# EAGLE design CAN_ProtoBoard_Pro_Mini (EAGLE 7.2.0)
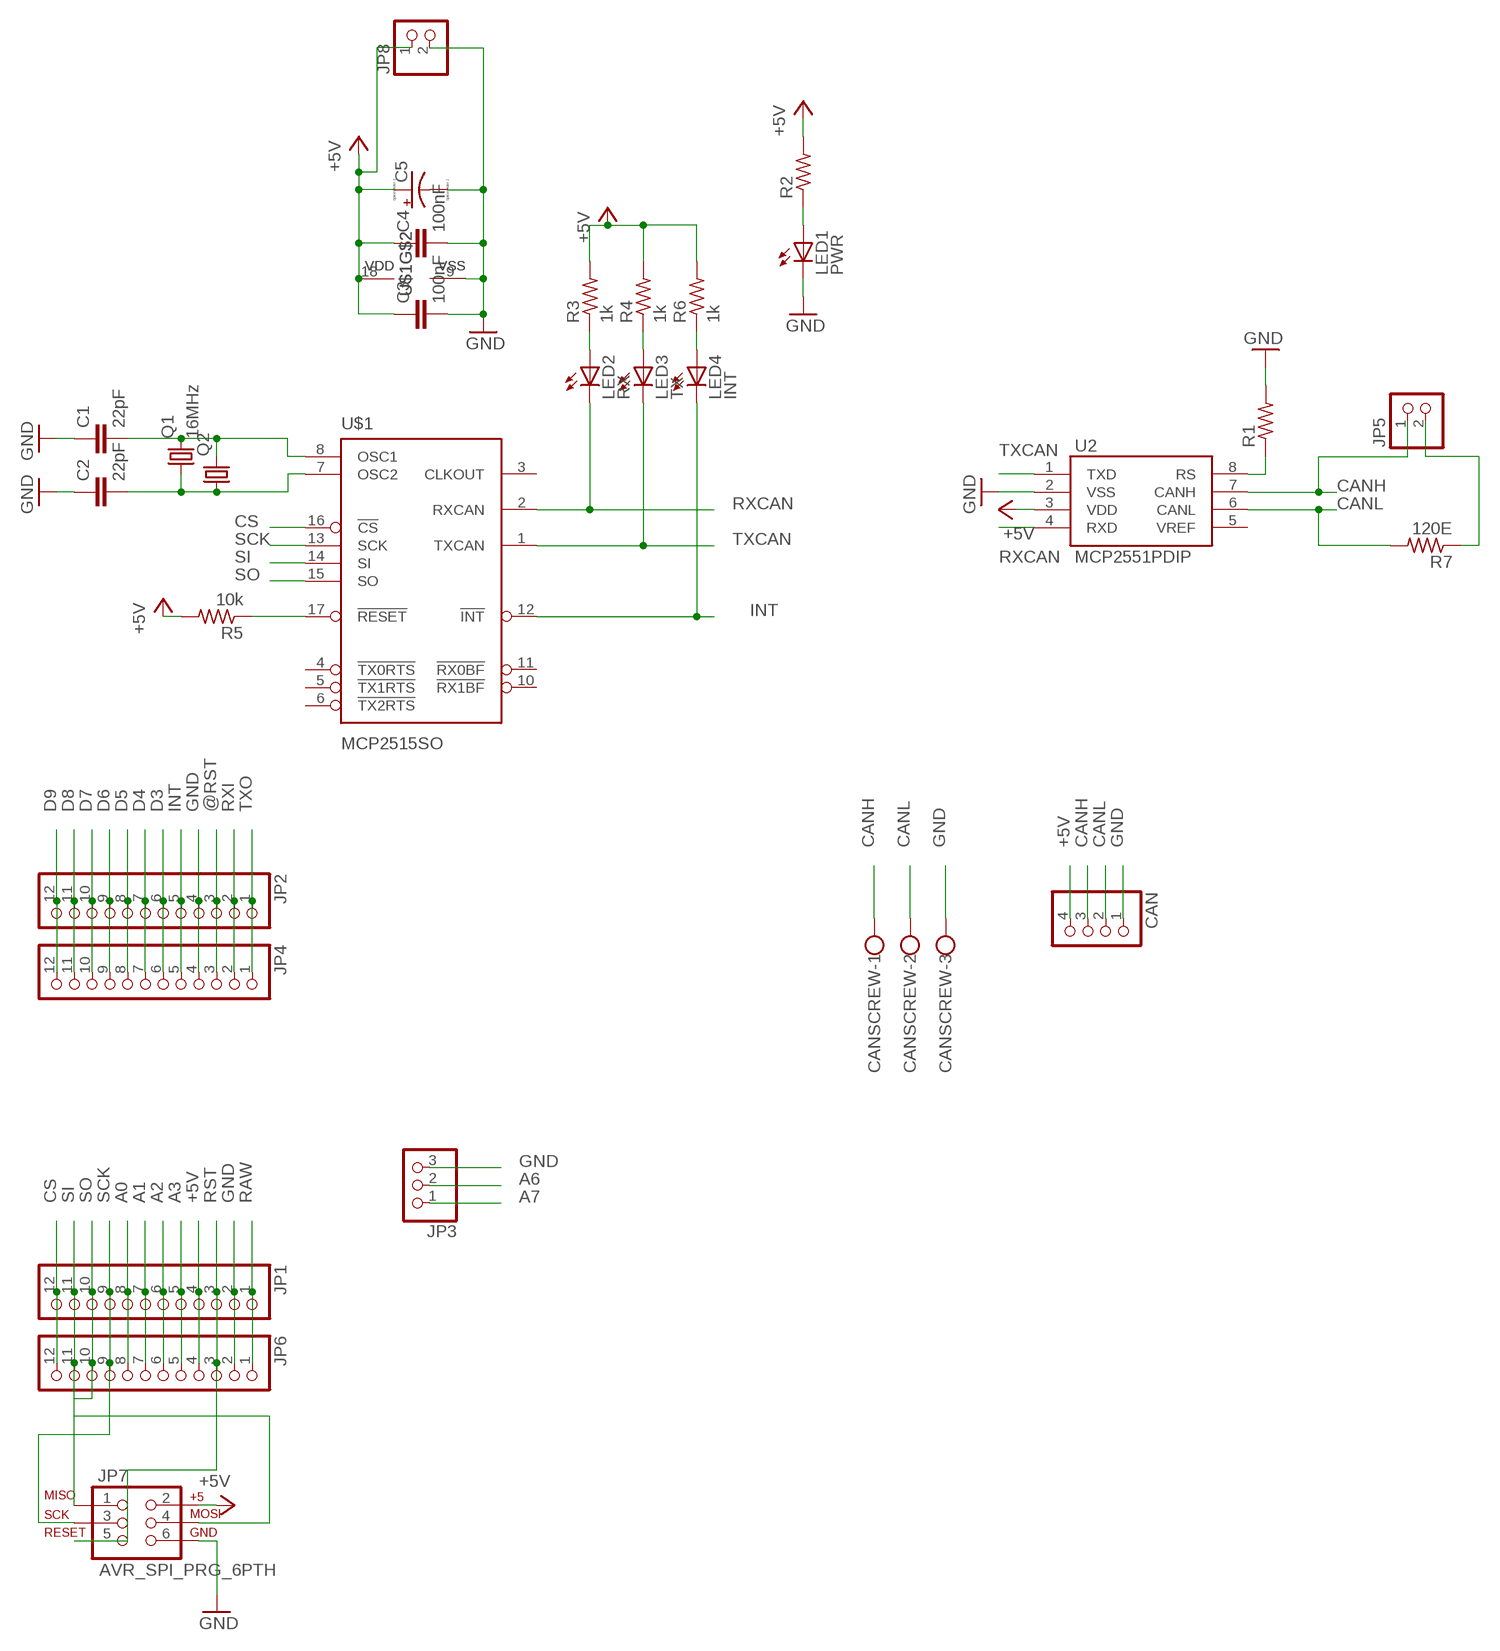
[diagram p0: schematic, sheet 1]

## Parts
C1  22pF  C-EUC0805K  [C0805K]
C2  22pF  C-EUC0805K  [C0805K]
C3  100nF  C-EUC0805K  [C0805K]
C4  100nF  C-EUC0805K  [C0805K]
C5  CPOL-USE5-8.5  [E5-8,5]
CAN  PINHD-1X4  [1X04]
CANSCREW  W237-103  [W237-103]
JP1  PINHD-1X12  [1X12]
JP2  PINHD-1X12  [1X12]
JP3  PINHD-1X3  [1X03]
JP4  PINHD-1X12  [1X12]
JP5  PINHD-1X2  [1X02]
JP6  PINHD-1X12  [1X12]
JP7  AVR_SPI_PRG_6PTH  [2X3]
JP8  PINHD-1X2  [1X02]
LED1  PWR  LED3MM  [LED3MM]
LED2  RX  LED3MM  [LED3MM]
LED3  TX  LED3MM  [LED3MM]
LED4  INT  LED3MM  [LED3MM]
Q1  16MHz  CRYSTALHC49S  [HC49/S]
Q2  CRYSTALHC49UP  [HC49UP]
R1  R-US_R0805  [R0805]
R2  R-US_R0805  [R0805]
R3  1k  R-US_R0805  [R0805]
R4  1k  R-US_R0805  [R0805]
R5  10k  R-US_R0805  [R0805]
R6  1k  R-US_R0805  [R0805]
R7  120E  R-US_R0805  [R0805]
U2  MCP2551PDIP  [DIL08]
U$1  MCP2515SO  [SO-18W]

## Nets
+5V: C3.1 C4.1 C5.+ CAN.4 JP1.4 JP6.4 JP7.2 JP8.1 R2.2 R3.2 R4.2 R5.2 R6.2 U2.3(VDD) U$1.18(VDD)
@RST: JP2.3 JP4.3
A0: JP1.8 JP6.8
A1: JP1.7 JP6.7
A2: JP1.6 JP6.6
A3: JP1.5 JP6.5
A6: JP3.2
A7: JP3.1
CANH: CAN.3 CANSCREW.1 JP5.1 U2.7(CANH)
CANL: CAN.2 CANSCREW.2 R7.2 U2.6(CANL)
CS: JP1.12 JP6.12 U$1.16(!CS)
D3: JP2.6 JP4.6
D4: JP2.7 JP4.7
D5: JP2.8 JP4.8
D6: JP2.9 JP4.9
D7: JP2.10 JP4.10
D8: JP2.11 JP4.11
D9: JP2.12 JP4.12
GND: C1.1 C2.1 C3.2 C4.2 C5.- CAN.1 CANSCREW.3 JP1.2 JP2.4 JP3.3 JP4.4 JP6.2 JP7.6 JP8.2 LED1.K(C) R1.2 U2.2(VSS) U$1.9(VSS)
INT: JP2.5 JP4.5 LED4.K(C) U$1.12(!INT)
N$1: C1.2 Q1.2 Q2.2 U$1.8(OSC1)
N$2: C2.2 Q1.1 Q2.1 U$1.7(OSC2)
N$3: LED2.A R3.1
N$4: LED3.A R4.1
N$5: R5.1 U$1.17(!RESET)
N$6: LED1.A R2.1
N$7: LED4.A R6.1
N$8: R1.1 U2.8(RS)
N$9: JP5.2 R7.1
RAW: JP1.1 JP6.1
RST: JP1.3 JP6.3 JP7.5
RXCAN: LED2.K(C) U2.4(RXD) U$1.2(RXCAN)
RXI: JP2.2 JP4.2
SCK: JP1.9 JP6.9 JP7.3 U$1.13(SCK)
SI: JP1.11 JP6.11 JP7.4 U$1.14(SI)
SO: JP1.10 JP6.10 JP7.1 U$1.15(SO)
TXCAN: LED3.K(C) U2.1(TXD) U$1.1(TXCAN)
TXO: JP2.1 JP4.1
Unconnected: U2.5(VREF) U$1.3(CLKOUT) U$1.4(!TX0RTS) U$1.5(!TX1RTS) U$1.6(!TX2RTS) U$1.10(!RX1BF) U$1.11(!RX0BF)

## Library data of the parts
C1-C4 = resistor:C-EU: CAPACITOR, European symbol
C5 = resistor:CPOL-US: POLARIZED CAPACITOR, American symbol
CAN = pinhead:PINHD-1X4: PIN HEADER
CANSCREW = con-wago-500:W237-103: WAGO SCREW CLAMP; MPN: 237-103; OC_FARNELL: unknown; OC_NEWARK: 18M7116
JP1 JP2 JP4 JP6 = pinhead:PINHD-1X12: PIN HEADER
JP3 = pinhead:PINHD-1X3: PIN HEADER
JP5 JP8 = pinhead:PINHD-1X2: PIN HEADER
JP7 = SparkFun-Connectors:AVR_SPI_PRG_6: AVR ISP 6 Pin This is the reduced ISP connector for AVR programming. Common on Arduino. This footprint will take up less PCB space and can be used with a 10-pin to 6-pin adapter such as SKU: BOB-08508 **Special note about "TEST_POINT" package. The stop mask is on the top side, so if you want your programming test points to be on the bottom of your board, make sure to place this package on the bottom side of the board. This also ensure that the orientation to program from the bottom side will be correct.
LED1-LED4 = led:LED: LED OSRAM: - CHIPLED LG R971, LG N971, LY N971, LG Q971, LY Q971, LO R971, LY R971 LH N974, LH R974 LS Q976, LO Q976, LY Q976 LO Q996 - Hyper CHIPLED LW Q18S LB Q993, LB Q99A, LB R99A - SideLED LS A670, LO A670, LY A670, LG A670, LP A670 LB A673, LV A673, LT A673, LW A673 LH A674 LY A675 LS A676, LA A676, LO A676, LY A676, LW A676 LS A679, LY A679, LG A679 - Hyper Micro SIDELED® LS Y876, LA Y876, LO Y876, LY Y876 LT Y87S - SmartLED LW L88C, LW L88S LB L89C, LB L89S, LG L890 LS L89K, LO L89K, LY L89K LS L896, LA L896, LO L896, LY L896 - TOPLED LS T670, LO T670, LY T670, LG T670, LP T670 LSG T670, LSP T670, LSY T670, LOP T670, LYG T670 LG T671, LOG T671, LSG T671 LB T673, LV T673, LT T673, LW T673 LH T674 LS T676, LA T676, LO T676, LY T676, LB T676, LH T676, LSB T676, LW T676 LB T67C, LV T67C, LT T67C, LS T67K, LO T67K, LY T67K, LW E67C LS E67B, LA E67B, LO E67B, LY E67B, LB E67C, LV E67C, LT E67C LW T67C LS T679, LY T679, LG T679 LS T770, LO T770, LY T770, LG T770, LP T770 LB T773, LV T773, LT T773, LW T773 LH T774 LS E675, LA E675, LY E675, LS T675 LS T776, LA T776, LO T776, LY T776, LB T776 LHGB T686 LT T68C, LB T68C - Hyper Mini TOPLED® LB M676 - Mini TOPLED Santana® LG M470 LS M47K, LO M47K, LY M47K Source: http://www.osram.convergy.de LUXEON: - LUMILED® LXK2-PW12-R00, LXK2-PW12-S00, LXK2-PW14-U00, LXK2-PW14-V00 LXK2-PM12-R00, LXK2-PM12-S00, LXK2-PM14-U00 LXK2-PE12-Q00, LXK2-PE12-R00, LXK2-PE12-S00, LXK2-PE14-T00, LXK2-PE14-U00 LXK2-PB12-K00, LXK2-PB12-L00, LXK2-PB12-M00, LXK2-PB14-N00, LXK2-PB14-P00, LXK2-PB14-Q00 LXK2-PR12-L00, LXK2-PR12-M00, LXK2-PR14-Q00, LXK2-PR14-R00 LXK2-PD12-Q00, LXK2-PD12-R00, LXK2-PD12-S00 LXK2-PH12-R00, LXK2-PH12-S00 LXK2-PL12-P00, LXK2-PL12-Q00, LXK2-PL12-R00 Source: www.luxeon.com KINGBRIGHT: KA-3528ASYC Source: www.kingbright.com
Q1 = crystal:CRYSTAL: CRYSTAL; OC_FARNELL: 1667008; OC_NEWARK: unknown
Q2 = crystal:CRYSTAL: CRYSTAL; OC_FARNELL: unknown; OC_NEWARK: unknown
R1-R7 = resistor:R-US_: RESISTOR, American symbol
U2 = RobThePyro:MCP2551: CAN transceiver
U$1 = RobThePyro:MCP2515: MCP2515 CAN Controller by Microchip

## Board
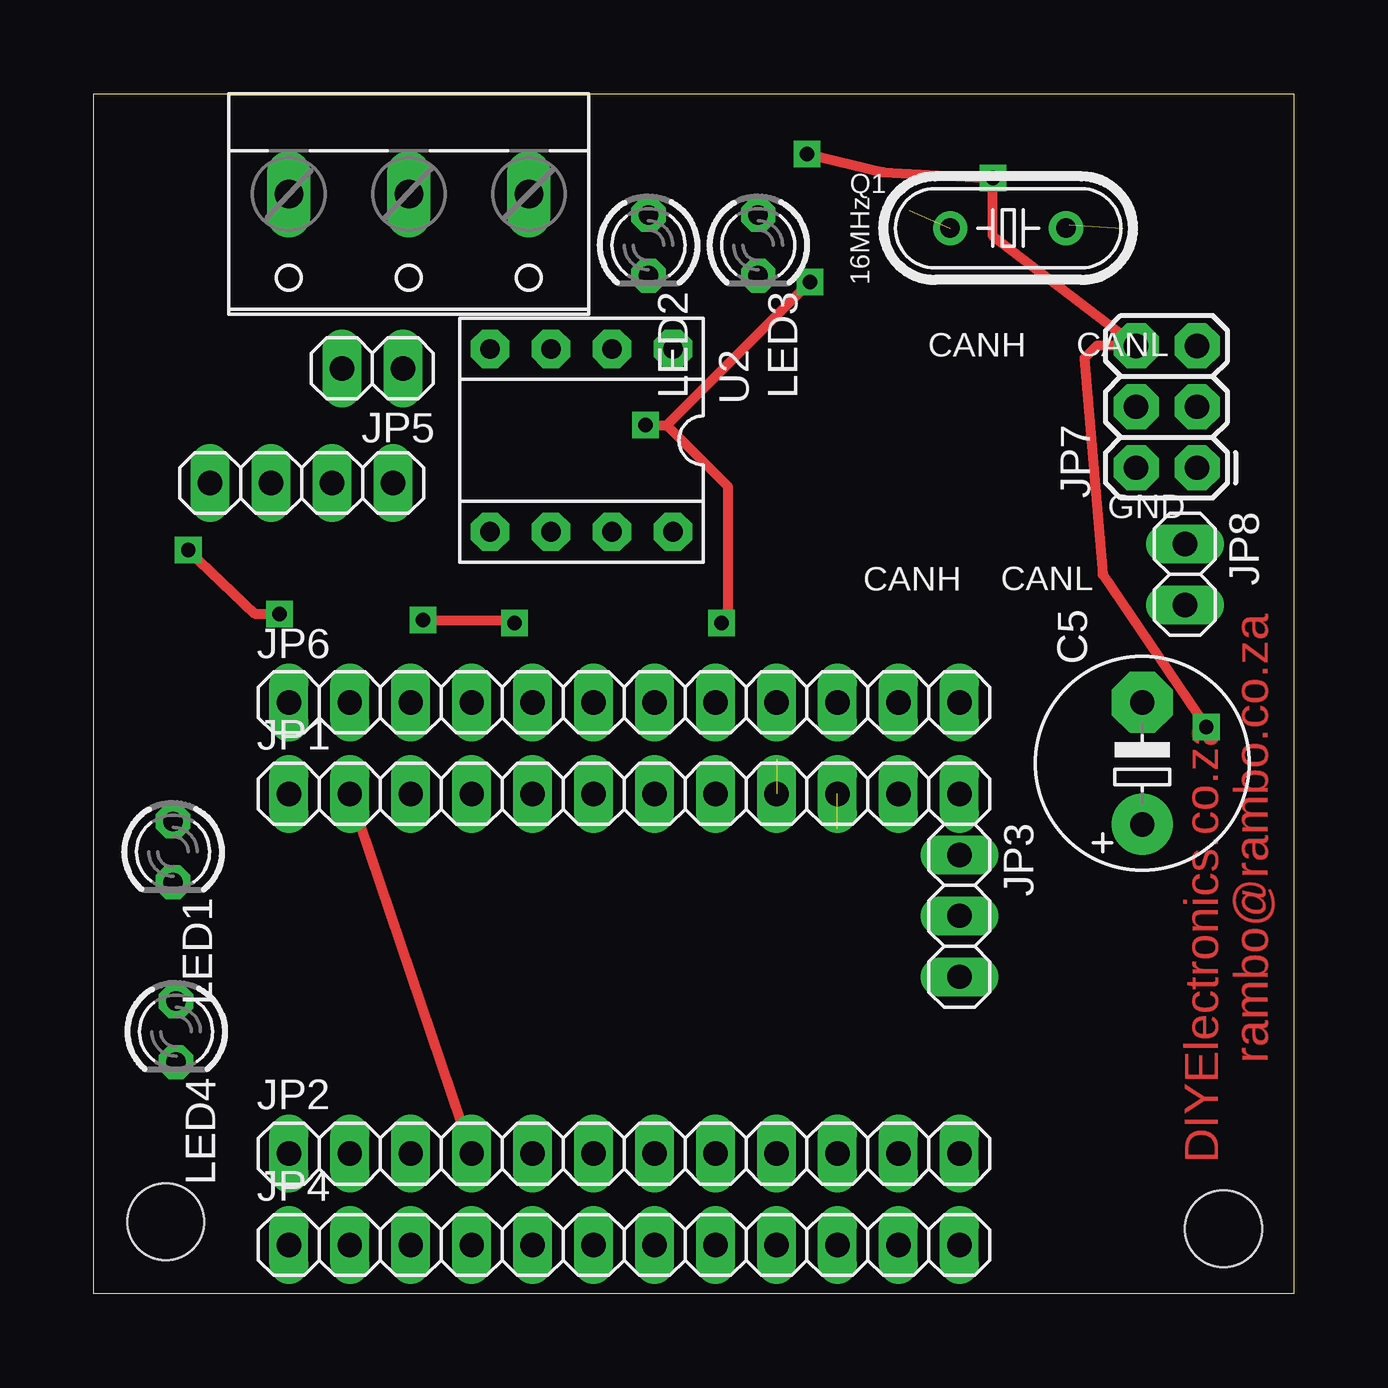
[diagram p1: board, top side]
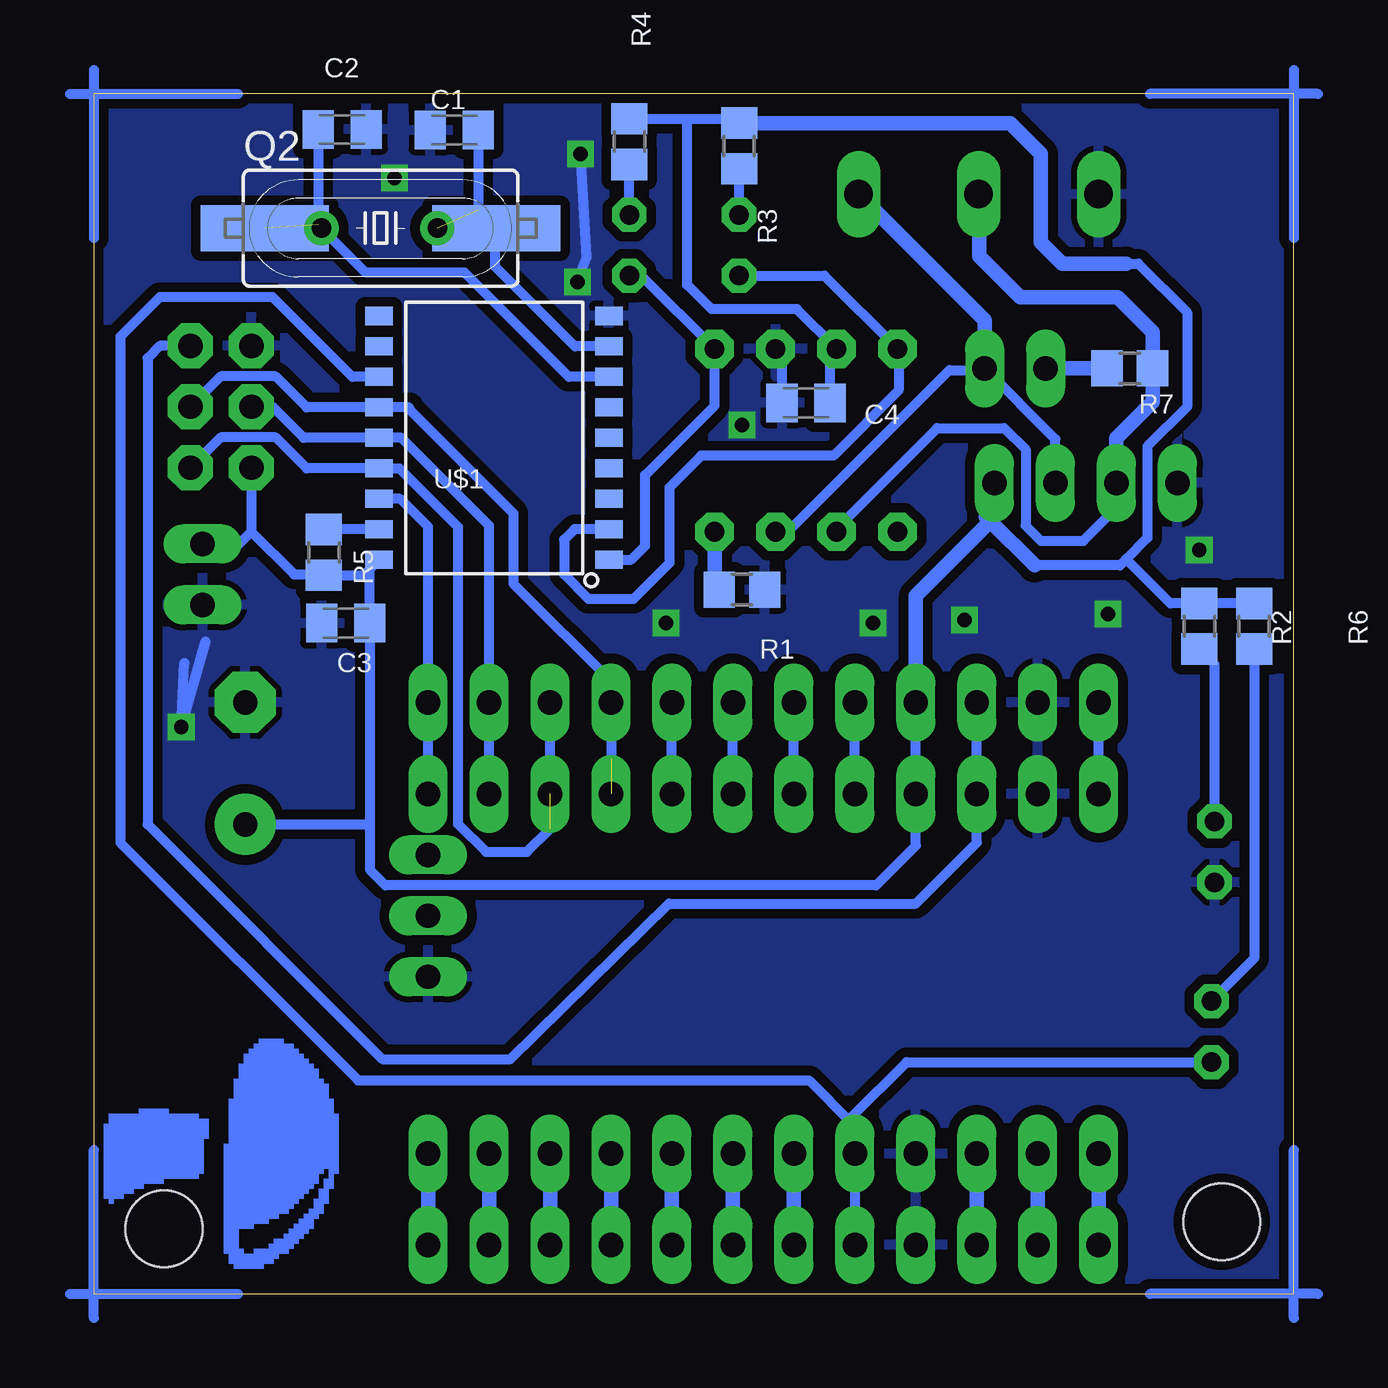
[diagram p2: board, bottom side, seen from below]

Size 50 x 50 mm. Coordinates in mm from the lower left corner, seen from the top.
Outline: 0,0 0,50 50,50 50,0 0,0
Copper layers (1*16): Top 0.035mm / dielectric 1.5mm / Bottom 0.035mm
Design rules "SparkFun": minimum track width 8mil, minimum drill 20mil, track to track 8mil, track to pad 8mil, pad to pad 8mil, via to via 8mil, smd to smd 8mil, copper to edge 10mil, drill to drill 8mil, minimum pad ring 12mil, minimum via ring 10mil, stop-mask expansion 4mil, vias tented up to drill 25mil, thermal gap 10mil
Holes 3.2 mm at 3,3 47.07,2.71

### Footprints (pad centres in the part's own frame; a part is rotated, then mirrored left to right if it is on the bottom)
C0805K = smd 1.3 x 1.6: 1 -1,0; 2 1,0
E5-8,5 = drill 1.016 pad 2.54: + -2.54,0 | drill 1.016 pad 2.54 octagon: - 2.54,0
1X04 = drill 1.016 long: 1 -3.81,0; 2 -1.27,0; 3 1.27,0; 4 3.81,0
W237-103 = drill 1.194 long: 1 -5,-1.29; 2 0,-1.29; 3 5,-1.29
1X12 = drill 1.016 long: 1 -13.97,0; 2 -11.43,0; 3 -8.89,0; 4 -6.35,0; 5 -3.81,0; 6 -1.27,0; 7 1.27,0; 8 3.81,0; 9 6.35,0; 10 8.89,0; 11 11.43,0; 12 13.97,0
1X03 = drill 1.016 long: 1 -2.54,0; 2 0,0; 3 2.54,0
1X02 = drill 1.016 long: 1 -1.27,0; 2 1.27,0
2X3 = drill 1.016 pad 1.88 octagon: 1 0,0; 2 0,2.54; 3 2.54,0; 4 2.54,2.54; 5 5.08,0; 6 5.08,2.54
LED3MM = drill 0.813 octagon: A -1.27,0; K 1.27,0
HC49/S = drill 0.813: 1 -2.413,0; 2 2.413,0
HC49UP = smd 5.334 x 1.93: 1 -4.826,0; 2 4.826,0
R0805 = smd 1.3 x 1.5: 1 -0.95,0; 2 0.95,0
DIL08 = drill 0.813 pad 1.6 octagon: 1 -3.81,-3.81; 2 -1.27,-3.81; 3 1.27,-3.81; 4 3.81,-3.81; 5 3.81,3.81; 6 1.27,3.81; 7 -1.27,3.81; 8 -3.81,3.81
SO-18W = smd 0.762 x 1.143: 1 -5.08,-4.788; 2 -3.81,-4.788; 3 -2.54,-4.788; 4 -1.27,-4.788; 5 0,-4.788; 6 1.27,-4.788; 7 2.54,-4.788; 8 3.81,-4.788; 9 5.08,-4.788; 10 5.08,4.788; 11 3.81,4.788; 12 2.54,4.788; 13 1.27,4.788; 14 0,4.788; 15 -1.27,4.788; 16 -2.54,4.788; 17 -3.81,4.788; 18 -5.08,4.788

### Placement (x,y rotation side)
C1  34.98,48.49 0 bottom
C2  39.65,48.51 180 bottom
C3  39.5,27.94 180 bottom
C4  20.32,37.12 180 bottom
C5  43.69,22.1 90 top
CAN  8.66,33.78 0 top
CANSCREW  13.13,44.53 180 top
JP1  22.1,20.83 0 top
JP2  22.1,5.84 0 top
JP3  36.07,15.75 270 top
JP4  22.1,2.03 0 top
JP5  11.61,38.56 180 top
JP6  22.1,24.64 0 top
JP7  45.97,34.42 90 top
JP8  45.47,29.97 270 top
LED1  3.3,18.41 270 top
LED2  23.11,43.69 270 top
LED3  27.69,43.69 270 top
LED4  3.43,10.92 270 top
Q1  38.1,44.4 180 top
Q2  38.05,44.4 0 bottom
R1  22.99,29.34 0 bottom
R2  3.94,27.81 90 bottom
R3  23.11,47.83 90 bottom
R4  27.69,48.01 90 bottom
R5  40.41,30.89 270 bottom
R6  1.65,27.81 90 bottom
R7  6.83,38.56 0 bottom
U2  20.32,35.56 180 top
U$1  33.33,35.67 90 bottom

### Tracks (layer width: path | path; a pad name or v marks a point on that pad's centre or on a via)
+5V
  Bottom 0.406: R4.2 25.4,48.96 | 25.4,48.96 23.29,48.96 R3.2 | 25.4,48.96 25.27,48.83 25.27,42.04 24.26,41.02 20.7,41.02 U2.3 19.32,39.1 C4.1 | JP6.4 JP1.4 15.75,18.67 17.4,17.02 37.85,17.02 38.5,17.67 38.5,19.68 | 12.83,32.38 12.57,32.64 12.57,33.68 CAN.4 | 6.99,30.61 6.1,31.5 6.1,35.31 4.45,36.96 4.45,40.89 6.48,42.93 6.99,42.93 | 6.99,30.61 7.24,30.35 10.79,30.35 | R6.2 R2.2 5.14,28.76 6.99,30.61 | JP7.2 43.43,31.75 | 43.43,31.75 41.66,29.97 40.44,29.97 R5.2 38.76,29.94 U$1.18 38.5,30.2 C3.1 38.5,19.68 | C5.+ 38.62,19.56 38.5,19.68 | JP8.1 43.94,31.24 43.43,31.75
  Bottom 0.61: R3.2 11.82,48.78 10.54,47.5 10.54,43.81 9.65,42.93 6.99,42.93 | 10.79,30.35 12.64,32.19 | 12.64,32.19 12.83,32.38 | JP6.4 15.75,29.08 12.64,32.19
@RST
  Bottom 0.61: JP4.3 JP2.3
A0
  Bottom 0.406: JP1.8 JP6.8
A1
  Bottom 0.406: JP1.7 JP6.7
A2
  Bottom 0.406: JP1.6 JP6.6
A3
  Bottom 0.406: JP1.5 JP6.5
CANH
  Bottom 0.406: CAN.3 9.93,35.61 JP5.1 12.95,38.48 14.35,38.48 21.08,31.75 U2.7
  Bottom 0.61: JP5.1 12.88,40.56 CANSCREW.1
CANL
  Bottom 0.406: U2.6 19.05,31.88 14.86,36.07 12.06,36.07 11.18,35.18 11.18,32 10.54,31.37 8.76,31.37 7.37,32.77 7.37,33.76 CAN.2
  Bottom 0.61: CAN.2 7.39,35.64 5.87,37.16 5.87,38.54 R7.2 5.88,40.07 7.34,41.53 11.4,41.53 13.11,43.23 13.11,45.79 CANSCREW.2
CS
  Bottom 0.406: U$1.16 37.24,33.12 36.07,31.95 JP6.12 JP1.12
D3
  Bottom 0.61: JP4.6 JP2.6
D4
  Bottom 0.61: JP4.7 JP2.7
D5
  Bottom 0.61: JP4.8 JP2.8
D6
  Bottom 0.61: JP4.9 JP2.9
D7
  Bottom 0.61: JP4.10 JP2.10
D8
  Bottom 0.61: JP4.11 JP2.11
D9
  Bottom 0.61: JP4.12 JP2.12
GND  (via drill 0.6)
  Top 0.406: v7.75,28.32 6.73,28.32 v3.94,30.99 | v13.72,28.07 17.4,28.07 v17.53,27.94 | v22.99,36.2 23.88,36.2 | 23.88,36.2 26.42,33.66 26.42,28.19 v26.16,27.94 | 23.88,36.2 v29.84,42.16 | v29.72,47.5 32.89,46.74 v37.47,46.48 37.47,44.07 JP7.6 41.78,39.5 41.27,38.99 42.04,29.97 v46.35,23.62 | JP2.4 JP1.2
  Bottom 0.406: C4.2 21.32,39.1 U2.2 | v29.84,42.16 29.46,43.18 v29.72,47.5 | 46.23,26.29 v46.35,23.62 45.34,27.18
  pour Bottom (isolate 0.406): 0,0 0,50.02 49.78,50.02 49.78,0
INT
  Bottom 0.406: U$1.12 39.22,38.21 42.55,41.53 47.24,41.53 48.9,39.88 48.9,18.8 38.99,8.89 20.19,8.89 18.41,7.11 | 18.41,7.11 18.41,5.97 JP2.5 JP4.5 | 18.41,7.11 18.41,7.37 16.13,9.65 LED4.K
N$1  (1 unrouted)
  Bottom 0.406: U$1.8 29.95,39.48 33.27,42.8 33.27,44.35 Q2.2 33.98,45.15 C1.2
N$2  (1 unrouted)
  Bottom 0.406: U$1.7 30.2,38.21 34.54,42.55 38.66,42.55 Q1.1 40.65,44.54 C2.2
N$3
  Bottom 0.406: LED2.A R3.1
N$4
  Bottom 0.406: LED3.A R4.1
N$5
  Bottom 0.406: U$1.17 40.39,31.86 R5.1
N$6
  Bottom 0.406: LED1.A 3.3,26.23 R2.1
N$7
  Bottom 0.406: R6.1 1.65,13.97 LED4.A
N$8
  Bottom 0.61: U2.8 24.13,29.53 R1.1
N$9
  Bottom 0.61: JP5.2 R7.1
N$10
  Bottom 0.406: 0,-1 0,6
N$11
  Bottom 0.406: -1,0 6,0
N$12
  Bottom 0.406: 50,-1 50,6
N$13
  Bottom 0.406: 51,0 44,0
N$14
  Bottom 0.406: 51,50 44,50
N$15
  Bottom 0.406: 50,51 50,44
N$16
  Bottom 0.406: 0,51 0,44
N$17
  Bottom 0.406: -1,50 6,50
RAW
  Bottom 0.406: JP1.1 JP6.1
RST
  Bottom 0.406: JP6.3 JP1.3 13.21,18.8 15.75,16.26 26.04,16.26 32.64,9.78 37.97,9.78 47.75,19.56 47.75,38.99 47.24,39.5 JP7.5
RXCAN
  Bottom 0.406: U$1.2 29.97,31.86 30.4,31.42 30.4,29.97 29.39,28.96 27.51,28.96 26.01,30.45 26.01,33.6 24.69,34.92 19.18,34.92 16.46,37.64 16.46,39.32 U2.4 19.56,42.42 LED2.K
RXI
  Bottom 0.61: JP4.2 JP2.2
SCK  (1 unrouted)
  Bottom 0.406: 28.45,22.3 JP6.9 28.32,24.77 28.32,25.4 32.51,29.59 32.51,32.51 36.85,36.85 36.85,36.93 U$1.13 41.13,36.94 42.42,38.23 44.7,38.23 JP7.3
SI
  Bottom 0.406: JP1.11 JP6.11 33.53,32 37.19,35.66 U$1.14 41.25,35.67 42.55,36.96 JP7.4
SO  (1 unrouted)
  Bottom 0.406: JP6.10 30.99,19.38 31.95,18.41 33.66,18.41 34.82,19.58 34.82,31.95 37.27,34.4 U$1.15 41.13,34.4 42.42,35.69 44.7,35.69 JP7.1
TXCAN
  Bottom 0.406: U$1.1 27.61,30.59 27.03,31.17 27.03,34.11 24.13,37.01 U2.1 27.18,42.42 LED3.K
TXO
  Bottom 0.61: JP4.1 JP2.1
(copper drawn outside any net)
  shapes: Bottom area x62

### Text on the board
Top: rambo@rambo.co.za | DIYElectronics.co.za
tNames: GND | CANH | CANL | K | GND | CANH | L | CANL | GND | J+ | GND